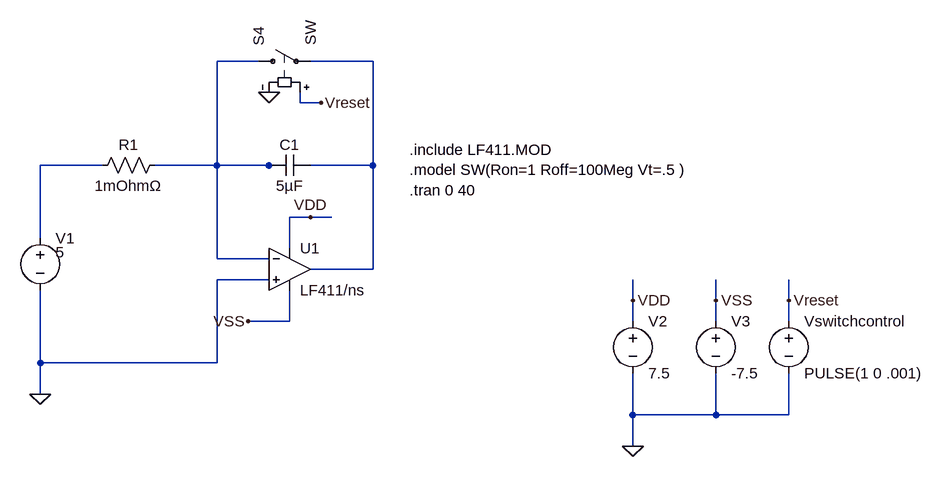
[diagram p0: schematic  Integrator with Reset (LTspice simulation).asc]
 Integrator with Reset (LTspice simulation).asc, the LTspice schematic file:
Version 4
SHEET 1 1520 1008
WIRE 496 400 432 400
WIRE 672 400 576 400
WIRE 560 464 560 448
WIRE 592 464 560 464
WIRE 256 560 160 560
WIRE 432 560 432 400
WIRE 432 560 336 560
WIRE 512 560 432 560
WIRE 528 560 512 560
WIRE 672 560 672 400
WIRE 672 560 576 560
WIRE 576 640 544 640
WIRE 608 640 576 640
WIRE 160 672 160 560
WIRE 544 688 544 640
WIRE 432 704 432 560
WIRE 512 704 432 704
WIRE 672 720 672 560
WIRE 672 720 576 720
WIRE 512 736 432 736
WIRE 1072 768 1072 736
WIRE 1200 768 1200 736
WIRE 1312 768 1312 736
WIRE 544 800 544 752
WIRE 544 800 480 800
WIRE 1072 800 1072 768
WIRE 1200 800 1200 768
WIRE 1312 800 1312 768
WIRE 160 864 160 752
WIRE 432 864 432 736
WIRE 432 864 160 864
WIRE 160 912 160 864
WIRE 1072 944 1072 880
WIRE 1200 944 1200 880
WIRE 1200 944 1072 944
WIRE 1312 944 1312 880
WIRE 1312 944 1200 944
WIRE 1072 992 1072 944
FLAG 160 912 0
FLAG 576 640 VDD
FLAG 480 800 VSS
FLAG 512 448 0
FLAG 592 464 Vreset
FLAG 1072 768 VDD
FLAG 1200 768 VSS
FLAG 1312 768 Vreset
FLAG 1072 992 0
DATAFLAG 624 720 "$"
SYMBOL voltage 160 656 R0
WINDOW 3 24 38 Left 2
SYMATTR InstName V1
SYMATTR Value 5
SYMBOL res 352 544 R90
WINDOW 0 0 56 VBottom 2
WINDOW 3 32 56 VTop 2
SYMATTR InstName R1
SYMATTR Value 1mOhmΩ
SYMBOL cap 576 544 R90
WINDOW 0 0 32 VBottom 2
WINDOW 3 32 32 VTop 2
SYMATTR InstName C1
SYMATTR Value 5µF
SYMBOL OpAmps/opamp2 544 656 R0
SYMATTR InstName U1
SYMATTR Value LF411/ns
SYMBOL sw 480 400 R270
SYMATTR InstName S4
SYMBOL voltage 1072 784 R0
SYMATTR InstName V2
SYMATTR Value 7.5
SYMBOL voltage 1200 784 R0
SYMATTR InstName V3
SYMATTR Value -7.5
SYMBOL voltage 1312 784 R0
SYMATTR InstName Vswitchcontrol
SYMATTR Value PULSE(1 0 .001)
TEXT 728 536 Left 2 !.include LF411.MOD\n.model SW(Ron=1 Roff=100Meg Vt=.5 )\n.tran 0 40

The netlist it stands for:
*  Integrator with Reset (LTspice simulation).asc
V1 N003 0 5
R1 N001 N003 1mOhmΩ
C1 N002 N001 5µF
XU1 0 N001 VDD VSS N002 LF411/ns  ; pins In+ In- V+ V- OUT
S4 N001 N002 Vreset 0 SW
V2 VDD 0 7.5
V3 VSS 0 -7.5
Vswitchcontrol Vreset 0 PULSE(1 0 .001)
.include LF411.MOD
.model SW(Ron=1 Roff=100Meg Vt=.5 )
.tran 0 40
.backanno
.end